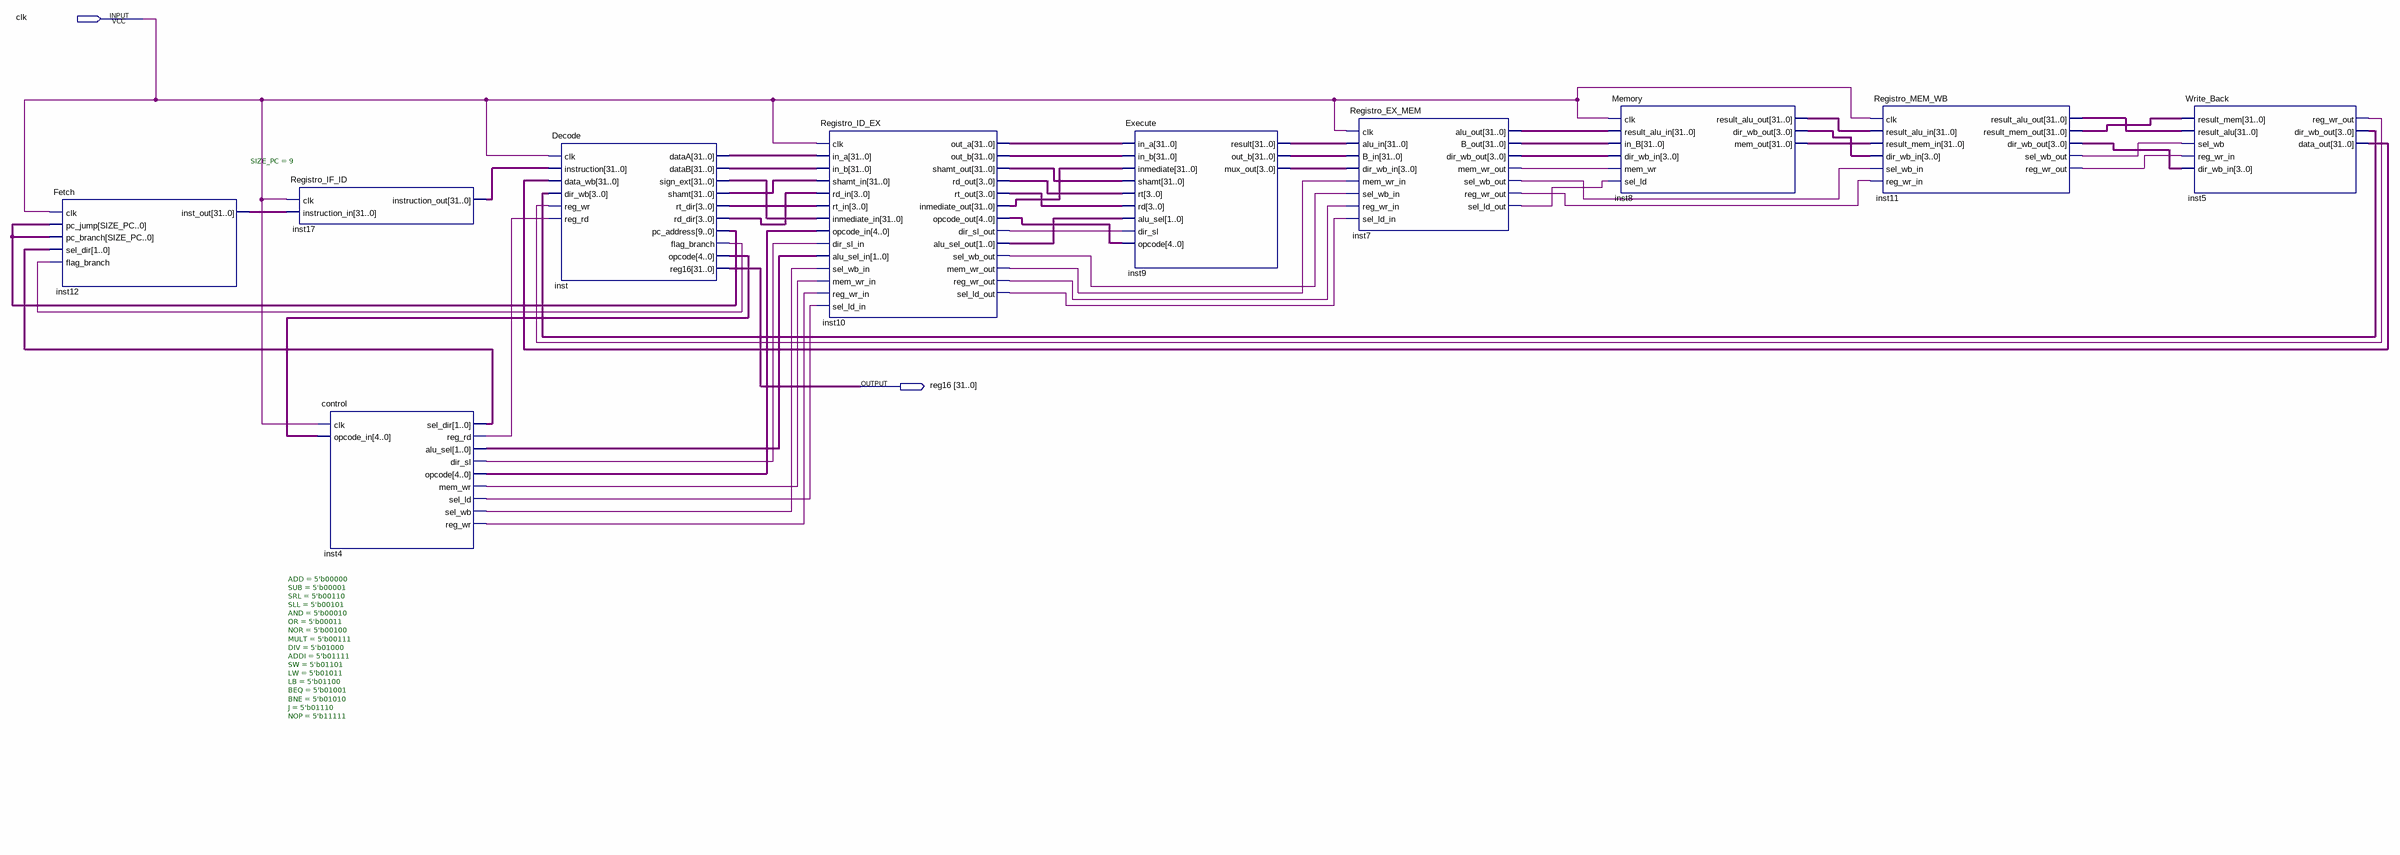
[diagram p0: schematic sheet]
// Quartus schematic procesadorJOF32_top.bdf as structural Verilog: 10 symbols, 2 pins
module procesadorJOF32_top (
  input  clk,
  output [31:0] reg16
);

  wire inst4_dir_sl, inst4_mem_wr, inst4_reg_rd, inst4_reg_wr, inst4_sel_ld, inst4_sel_wb, inst5_reg_wr_out,
       inst7_mem_wr_out, inst7_reg_wr_out, inst7_sel_ld_out, inst7_sel_wb_out, inst10_dir_sl_out,
       inst10_mem_wr_out, inst10_reg_wr_out, inst10_sel_ld_out, inst10_sel_wb_out, inst11_reg_wr_out,
       inst11_sel_wb_out, inst_flag_branch;
  wire [1:0] inst4_alu_sel, inst4_sel_dir, inst10_alu_sel_out;
  wire [3:0] inst5_dir_wb_out, inst7_dir_wb_out, inst8_dir_wb_out, inst9_mux_out, inst10_rd_out,
       inst10_rt_out, inst11_dir_wb_out, inst_rd_dir, inst_rt_dir;
  wire [4:0] inst4_opcode, inst10_opcode_out, inst_opcode;
  wire [9:0] inst_pc_address;
  wire [31:0] inst5_data_out, inst7_alu_out, inst7_b_out, inst8_mem_out, inst8_result_alu_out, inst9_out_b,
       inst9_result, inst10_inmediate_out, inst10_out_a, inst10_out_b, inst10_shamt_out,
       inst11_result_alu_out, inst11_result_mem_out, inst12_inst_out, inst17_instruction_out, inst_dataa,
       inst_datab, inst_shamt, inst_sign_ext;

  Fetch #(.SIZE_PC(9)) inst12 (
    .clk(clk), .pc_jump(inst_pc_address), .pc_branch(inst_pc_address), .sel_dir(inst4_sel_dir),
    .flag_branch(inst_flag_branch), .inst_out(inst12_inst_out));
  Registro_IF_ID inst17 (.clk(clk), .instruction_in(inst12_inst_out), .instruction_out(inst17_instruction_out));
  control #(.ADD(5'b00000), .SUB(5'b00001), .SRL(5'b00110), .SLL(5'b00101), .AND(5'b00010), .OR(5'b00011), .NOR(5'b00100), .MULT(5'b00111), .DIV(5'b01000), .ADDI(5'b01111), .SW(5'b01101), .LW(5'b01011), .LB(5'b01100), .BEQ(5'b01001), .BNE(5'b01010), .J(5'b01110), .NOP(5'b11111)) inst4 (
    .clk(clk), .opcode_in(inst_opcode), .sel_dir(inst4_sel_dir), .reg_rd(inst4_reg_rd),
    .alu_sel(inst4_alu_sel), .dir_sl(inst4_dir_sl), .opcode(inst4_opcode), .mem_wr(inst4_mem_wr),
    .sel_ld(inst4_sel_ld), .sel_wb(inst4_sel_wb), .reg_wr(inst4_reg_wr));
  Decode inst (
    .clk(clk), .instruction(inst17_instruction_out), .data_wb(inst5_data_out), .dir_wb(inst5_dir_wb_out),
    .reg_wr(inst5_reg_wr_out), .reg_rd(inst4_reg_rd), .dataA(inst_dataa), .dataB(inst_datab),
    .sign_ext(inst_sign_ext), .shamt(inst_shamt), .rt_dir(inst_rt_dir), .rd_dir(inst_rd_dir),
    .pc_address(inst_pc_address), .flag_branch(inst_flag_branch), .opcode(inst_opcode), .reg16(reg16));
  Registro_ID_EX inst10 (
    .clk(clk), .in_a(inst_dataa), .in_b(inst_datab), .shamt_in(inst_shamt), .rd_in(inst_rd_dir),
    .rt_in(inst_rt_dir), .inmediate_in(inst_sign_ext), .opcode_in(inst4_opcode), .dir_sl_in(inst4_dir_sl),
    .alu_sel_in(inst4_alu_sel), .sel_wb_in(inst4_sel_wb), .mem_wr_in(inst4_mem_wr), .reg_wr_in(inst4_reg_wr),
    .sel_ld_in(inst4_sel_ld), .out_a(inst10_out_a), .out_b(inst10_out_b), .shamt_out(inst10_shamt_out),
    .rd_out(inst10_rd_out), .rt_out(inst10_rt_out), .inmediate_out(inst10_inmediate_out),
    .opcode_out(inst10_opcode_out), .dir_sl_out(inst10_dir_sl_out), .alu_sel_out(inst10_alu_sel_out),
    .sel_wb_out(inst10_sel_wb_out), .mem_wr_out(inst10_mem_wr_out), .reg_wr_out(inst10_reg_wr_out),
    .sel_ld_out(inst10_sel_ld_out));
  Execute inst9 (
    .in_a(inst10_out_a), .in_b(inst10_out_b), .inmediate(inst10_inmediate_out), .shamt(inst10_shamt_out),
    .rt(inst10_rd_out), .rd(inst10_rt_out), .alu_sel(inst10_alu_sel_out), .dir_sl(inst10_dir_sl_out),
    .opcode(inst10_opcode_out), .result(inst9_result), .out_b(inst9_out_b), .mux_out(inst9_mux_out));
  Registro_EX_MEM inst7 (
    .clk(clk), .alu_in(inst9_result), .B_in(inst9_out_b), .dir_wb_in(inst9_mux_out),
    .mem_wr_in(inst10_mem_wr_out), .sel_wb_in(inst10_sel_wb_out), .reg_wr_in(inst10_reg_wr_out),
    .sel_ld_in(inst10_sel_ld_out), .alu_out(inst7_alu_out), .B_out(inst7_b_out),
    .dir_wb_out(inst7_dir_wb_out), .mem_wr_out(inst7_mem_wr_out), .sel_wb_out(inst7_sel_wb_out),
    .reg_wr_out(inst7_reg_wr_out), .sel_ld_out(inst7_sel_ld_out));
  Memory inst8 (
    .clk(clk), .result_alu_in(inst7_alu_out), .in_B(inst7_b_out), .dir_wb_in(inst7_dir_wb_out),
    .mem_wr(inst7_mem_wr_out), .sel_ld(inst7_sel_ld_out), .result_alu_out(inst8_result_alu_out),
    .dir_wb_out(inst8_dir_wb_out), .mem_out(inst8_mem_out));
  Registro_MEM_WB inst11 (
    .clk(clk), .result_alu_in(inst8_result_alu_out), .result_mem_in(inst8_mem_out),
    .dir_wb_in(inst8_dir_wb_out), .sel_wb_in(inst7_sel_wb_out), .reg_wr_in(inst7_reg_wr_out),
    .result_alu_out(inst11_result_alu_out), .result_mem_out(inst11_result_mem_out),
    .dir_wb_out(inst11_dir_wb_out), .sel_wb_out(inst11_sel_wb_out), .reg_wr_out(inst11_reg_wr_out));
  Write_Back inst5 (
    .result_mem(inst11_result_mem_out), .result_alu(inst11_result_alu_out), .sel_wb(inst11_sel_wb_out),
    .reg_wr_in(inst11_reg_wr_out), .dir_wb_in(inst11_dir_wb_out), .reg_wr_out(inst5_reg_wr_out),
    .dir_wb_out(inst5_dir_wb_out), .data_out(inst5_data_out));
endmodule
